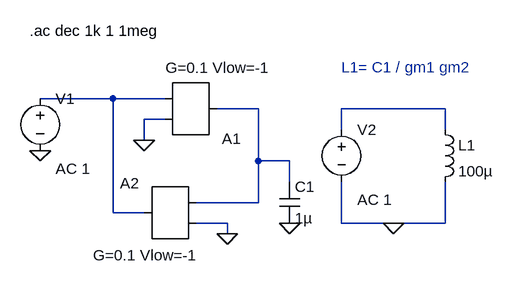
[diagram p0: schematic EJE5_B.asc]
EJE5_B.asc, the LTspice schematic file:
Version 4
SHEET 1 880 680
WIRE -80 176 -192 176
WIRE 0 176 -80 176
WIRE 144 192 80 192
WIRE 432 192 272 192
WIRE 0 208 -32 208
WIRE 272 224 272 192
WIRE 432 224 432 192
WIRE -32 240 -32 208
WIRE 144 272 144 192
WIRE 192 272 144 272
WIRE 192 304 192 272
WIRE 144 336 144 272
WIRE 144 336 48 336
WIRE -80 352 -80 176
WIRE -32 352 -80 352
WIRE 96 368 48 368
WIRE 272 368 272 304
WIRE 352 368 272 368
WIRE 432 368 432 304
WIRE 432 368 352 368
WIRE 96 384 96 368
FLAG -192 256 0
FLAG -32 240 0
FLAG 96 384 0
FLAG 192 368 0
FLAG 352 368 0
SYMBOL voltage -192 160 R0
WINDOW 123 24 124 Left 2
SYMATTR Value2 AC 1
SYMATTR InstName V1
SYMATTR Value ""
SYMBOL SpecialFunctions\\ota 32 256 M180
WINDOW 3 -31 127 Left 2
SYMATTR Value G=0.1 Vlow=-1
SYMATTR InstName A1
SYMBOL SpecialFunctions\\ota 16 288 M0
WINDOW 3 -35 129 Left 2
SYMATTR Value G=0.1 Vlow=-1
SYMATTR InstName A2
SYMBOL cap 176 304 R0
SYMATTR InstName C1
SYMATTR Value 1µ
SYMBOL ind 416 208 R0
SYMATTR InstName L1
SYMATTR Value 100µ
SYMBOL voltage 272 208 R0
WINDOW 123 24 124 Left 2
SYMATTR Value2 AC 1
SYMATTR InstName V2
SYMATTR Value ""
TEXT -208 72 Left 2 !.ac dec 1k 1 1meg
TEXT 272 128 Left 2 ;L1= C1 / gm1 gm2

The netlist it stands for:
* EJE5_B.asc
V1 N001 0 AC 1
A1 0 N001 0 0 0 0 N002 0 OTA G=0.1 Vlow=-1
A2 N002 0 0 0 0 0 N001 0 OTA G=0.1 Vlow=-1
C1 N002 0 1µ
L1 N003 0 100µ
V2 N003 0 AC 1
.ac dec 1k 1 1meg
* L1= C1 / gm1 gm2
.backanno
.end